# EAGLE design dvradapter (EAGLE 5.11)
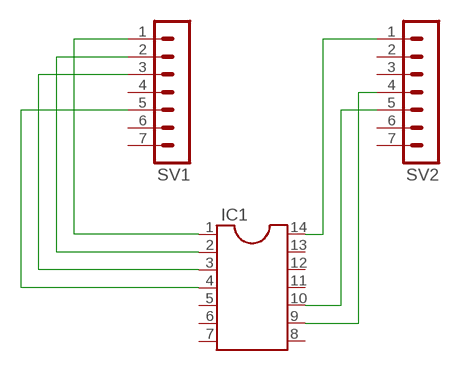
[diagram p0: schematic, sheet 1]

## Parts
IC1  DIL14S  [SOCKET-14]
SV1  MA07-1  [MA07-1]
SV2  MA07-1  [MA07-1]

## Nets
N$1: IC1.1 SV1.1
N$2: IC1.2 SV1.2
N$3: IC1.3 SV1.3
N$4: IC1.4 SV1.5
N$5: IC1.14 SV2.1
N$6: IC1.10 SV2.5
N$7: IC1.9 SV2.4
Unconnected: IC1.5 IC1.6 IC1.7 IC1.8 IC1.11 IC1.12 IC1.13 SV1.4 SV1.6 SV1.7 SV2.2 SV2.3 SV2.6 SV2.7

## Library data of the parts
IC1 = ic-package:DIL14: Dual In Line / Socket
SV1 SV2 = con-lstb:MA07-1: PIN HEADER; OC_FARNELL: unknown; OC_NEWARK: unknown

## Board
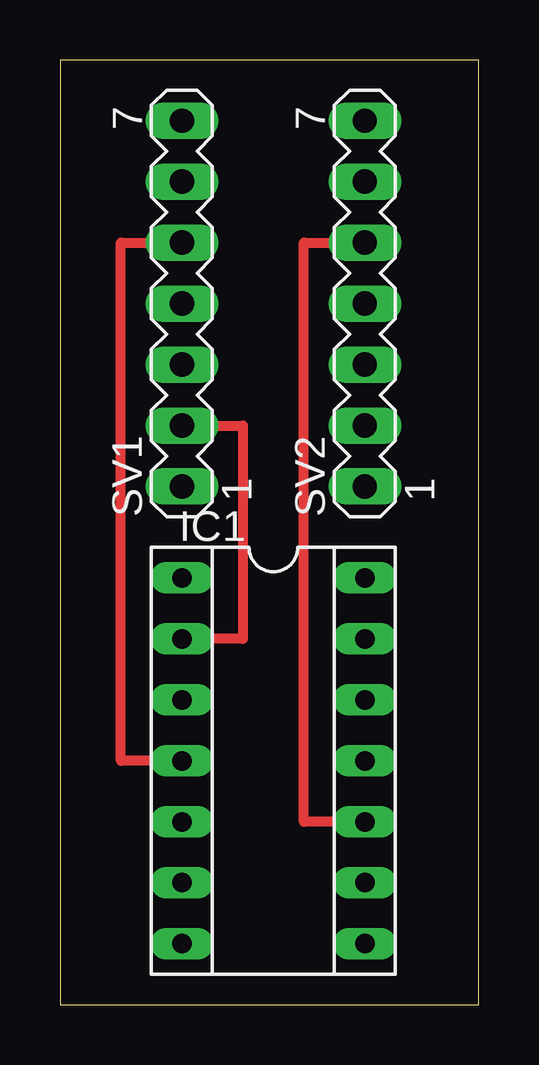
[diagram p1: board, top side]
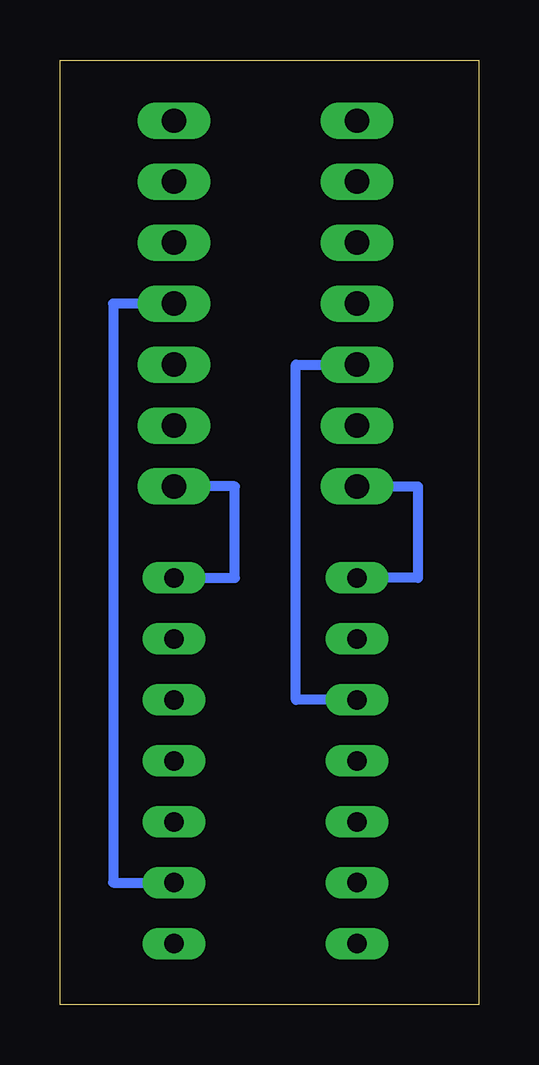
[diagram p2: board, bottom side, seen from below]

Size 17.45 x 39.36 mm. Coordinates in mm from the lower left corner, seen from the top.
Outline: 0,0 17.45,0 17.45,39.36 0,39.36 0,0
Copper layers (1*16): Top 0.035mm / dielectric 1.5mm / Bottom 0.035mm
Design rules "default": minimum track width 10mil, minimum drill 24mil, track to track 8mil, track to pad 8mil, pad to pad 8mil, via to via 8mil, smd to smd 8mil, copper to edge 40mil, drill to drill 8mil, minimum pad ring 10mil, minimum via ring 8mil, stop-mask expansion 4mil, vias tented up to drill 0mil, thermal gap 10mil

### Footprints (pad centres in the part's own frame; a part is rotated, then mirrored left to right if it is on the bottom)
SOCKET-14 = drill 0.813 long: 1 -7.62,-3.81; 2 -5.08,-3.81; 3 -2.54,-3.81; 4 0,-3.81; 5 2.54,-3.81; 6 5.08,-3.81; 7 7.62,-3.81; 8 7.62,3.81; 9 5.08,3.81; 10 2.54,3.81; 11 0,3.81; 12 -2.54,3.81; 13 -5.08,3.81; 14 -7.62,3.81
MA07-1 = drill 1.016 long: 1 -7.62,0; 2 -5.08,0; 3 -2.54,0; 4 0,0; 5 2.54,0; 6 5.08,0; 7 7.62,0

### Placement (x,y rotation side)
IC1  8.89,10.16 270 top
SV1  5.08,29.21 90 top
SV2  12.7,29.21 90 top

### Tracks (layer width: path | path; a pad name or v marks a point on that pad's centre or on a via)
N$1
  Bottom 0.406: SV1.1 2.54,21.59 2.54,17.78 IC1.1
N$2
  Top 0.406: SV1.2 7.62,24.13 7.62,15.24 IC1.2
N$3
  Bottom 0.406: IC1.3 7.62,12.7 7.62,26.67 SV1.3
N$4
  Top 0.406: IC1.4 2.54,10.16 2.54,31.75 SV1.5
N$5
  Bottom 0.406: IC1.14 10.16,17.78 10.16,21.59 SV2.1
N$6
  Top 0.406: IC1.10 10.16,7.62 10.16,31.75 SV2.5
N$7
  Bottom 0.406: SV2.4 15.24,29.21 15.24,5.08 IC1.9